# EAGLE design breakout (EAGLE 6.6.0)
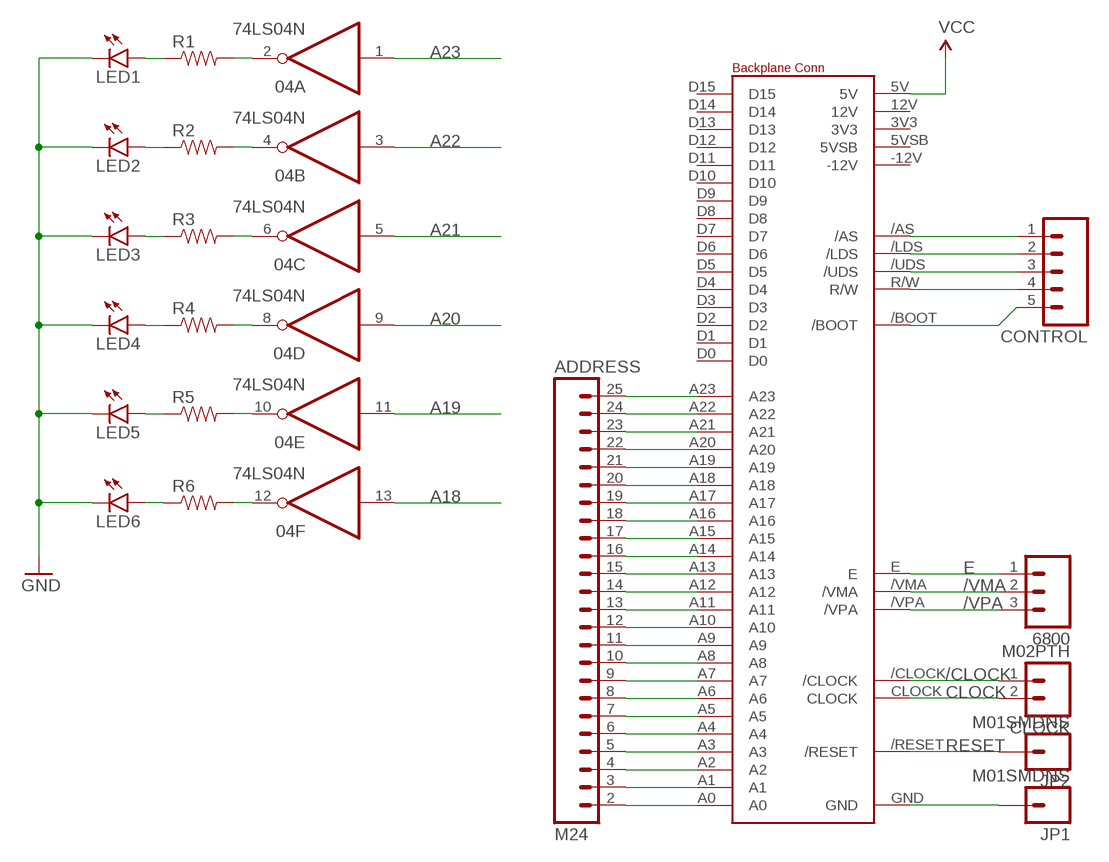
[diagram p0: schematic, sheet 1]

## Parts
04  74LS04N  [DIL14]
6800  M03PTH  [1X03]
ADDRESS  M24  [1X24]
CLOCK  M02PTH  [1X02]
CONTROL  M05PTH  [1X05]
JP1  M01SMDNS  [1X01NS]
JP2  M01SMDNS  [1X01NS]
LED1  LED1206  [LED-1206]
LED2  LED1206  [LED-1206]
LED3  LED1206  [LED-1206]
LED4  LED1206  [LED-1206]
LED5  LED1206  [LED-1206]
LED6  LED1206  [LED-1206]
R1  RESISTOR0603-RES  [0603-RES]
R2  RESISTOR0603-RES  [0603-RES]
R3  RESISTOR0603-RES  [0603-RES]
R4  RESISTOR0603-RES  [0603-RES]
R5  RESISTOR0603-RES  [0603-RES]
R6  RESISTOR0603-RES  [0603-RES]
U$1  BACKPLANENOHOLES  [41612-C]

## Nets
/AS: CONTROL.1 U$1./AS
/BOOT: CONTROL.5 U$1./BOOT
/CLOCK: CLOCK.1 U$1./CLOCK
/LDS: CONTROL.2 U$1./LDS
/UDS: CONTROL.3 U$1./UDS
/VMA: 6800.2 U$1./VMA
/VPA: 6800.3 U$1./VPA
A0: ADDRESS.2 U$1.A0
A1: ADDRESS.3 U$1.A1
A2: ADDRESS.4 U$1.A2
A3: ADDRESS.5 U$1.A3
A4: ADDRESS.6 U$1.A4
A5: ADDRESS.7 U$1.A5
A6: ADDRESS.8 U$1.A6
A7: ADDRESS.9 U$1.A7
A8: ADDRESS.10 U$1.A8
A9: ADDRESS.11 U$1.A9
A10: ADDRESS.12 U$1.A10
A11: ADDRESS.13 U$1.A11
A12: ADDRESS.14 U$1.A12
A13: ADDRESS.15 U$1.A13
A14: ADDRESS.16 U$1.A14
A15: ADDRESS.17 U$1.A15
A16: ADDRESS.18 U$1.A16
A17: ADDRESS.19 U$1.A17
A18: 04.13(F:I) ADDRESS.20 U$1.A18
A19: 04.11(E:I) ADDRESS.21 U$1.A19
A20: 04.9(D:I) ADDRESS.22 U$1.A20
A21: 04.5(C:I) ADDRESS.23 U$1.A21
A22: 04.3(B:I) ADDRESS.24 U$1.A22
A23: 04.1(A:I) ADDRESS.25 U$1.A23
CLOCK: CLOCK.2 U$1.CLOCK
E: 6800.1 U$1.E
GND: JP1.1 LED1.C LED2.C LED3.C LED4.C LED5.C LED6.C U$1.GND
N$1: 04.2(A:O) R1.2
N$2: 04.4(B:O) R2.2
N$3: 04.6(C:O) R3.2
N$4: 04.8(D:O) R4.2
N$5: 04.10(E:O) R5.2
N$6: 04.12(F:O) R6.2
N$7: LED6.A R6.1
N$8: LED5.A R5.1
N$9: LED4.A R4.1
N$10: LED3.A R3.1
N$11: LED2.A R2.1
N$12: LED1.A R1.1
R/W: CONTROL.4 U$1.R/W
RESET: JP2.1 U$1./RESET
VCC: U$1.5V
Unconnected: U$1.3V3 U$1.5VSB U$1.12V U$1.-12V U$1.D0 U$1.D1 U$1.D2 U$1.D3 U$1.D4 U$1.D5 U$1.D6 U$1.D7 U$1.D8 U$1.D9 U$1.D10 U$1.D11 U$1.D12 U$1.D13 U$1.D14 U$1.D15

## Power pins joined to a net without a drawn wire
GND: 04.7(P:GND)
VCC: 04.14(P:VCC)

## Library data of the parts
04 = 74xx-eu:74*04: Hex INVERTER
6800 = SparkFun-Connectors:M03: Header 3 Standard 3-pin 0.1" header. Use with straight break away headers (SKU : PRT-00116), right angle break away headers (PRT-00553), swiss pins (PRT-00743), machine pins (PRT-00117), and female headers (PRT-00115). Molex polarized connector foot print use with SKU : PRT-08232 with associated crimp pins and housings.
ADDRESS = SparkFun-Connectors:M24: 1x24 .1" header
CLOCK = SparkFun-Connectors:M02: Standard 2-pin 0.1" header. Use with - straight break away headers ( PRT-00116) - right angle break away headers (PRT-00553) - swiss pins (PRT-00743) - machine pins (PRT-00117) - female headers (PRT-00115) Molex polarized connector foot print use with: PRT-08233 with associated crimp pins and housings. 2.54_SCREWTERM for use with PRT-10571. 3.5mm Screw Terminal footprints for PRT-08084 5mm Screw Terminal footprints for use with PRT-08432
CONTROL = SparkFun-Connectors:M05: Header 5 Standard 5-pin 0.1" header. Use with straight break away headers (SKU : PRT-00116), right angle break away headers (PRT-00553), swiss pins (PRT-00743), machine pins (PRT-00117), and female headers (PRT-00115). Molex polarized connector foot print use with SKU : PRT-08230 with associated crimp pins and housings.
JP1 JP2 = SparkFun-Connectors:M01: Header 1 Standard 1-pin 0.1" header. Use with straight break away headers (SKU : PRT-00116), right angle break away headers (PRT-00553), swiss pins (PRT-00743), machine pins (PRT-00117), and female headers (PRT-00115).
LED1-LED6 = SparkFun-LED:LED: LEDs Standard schematic elements and footprints for 5mm, 3mm, 1206, and 0603 sized LEDs. 5mm - Spark Fun Electronics SKU : COM-00529 (and others)
R1-R6 = SparkFun-Passives:RESISTOR: Resistor Basic schematic elements and footprints for 0603, 1206, and PTH resistors.
U$1 = Benchoff2:BACKPLANENOHOLES

## Board
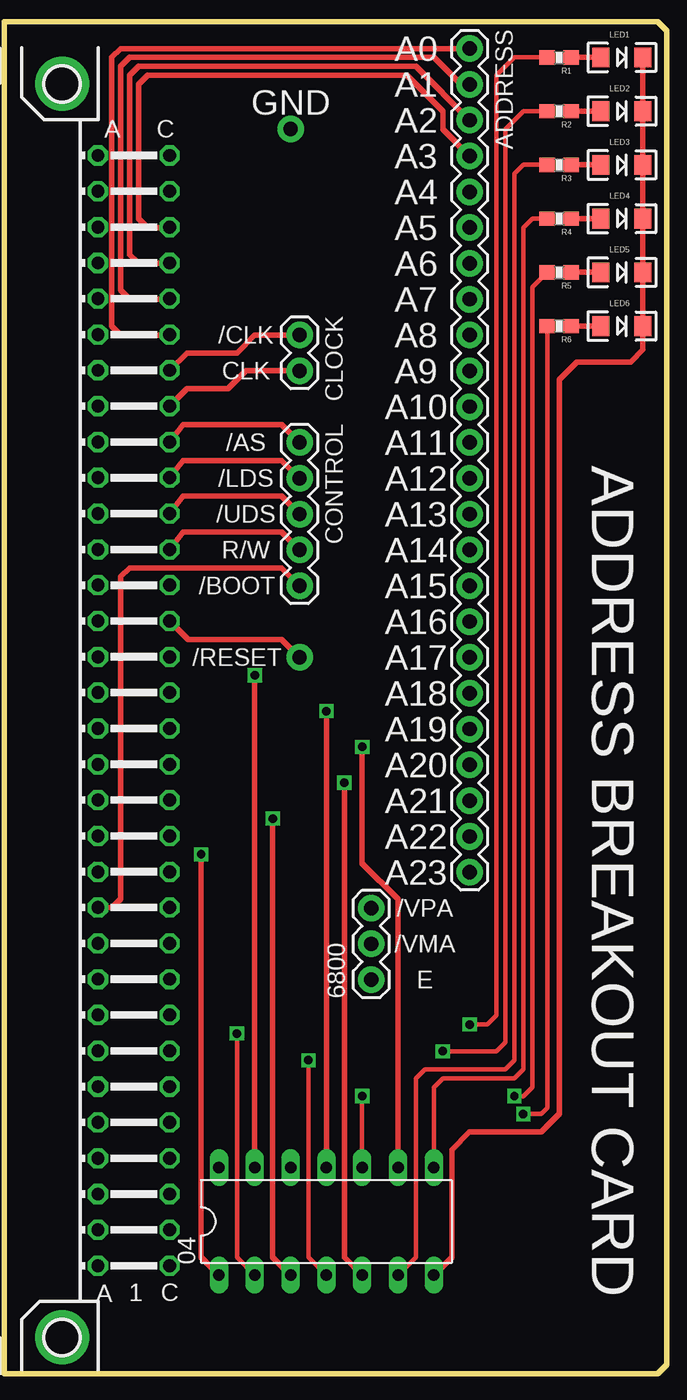
[diagram p1: board, top side]
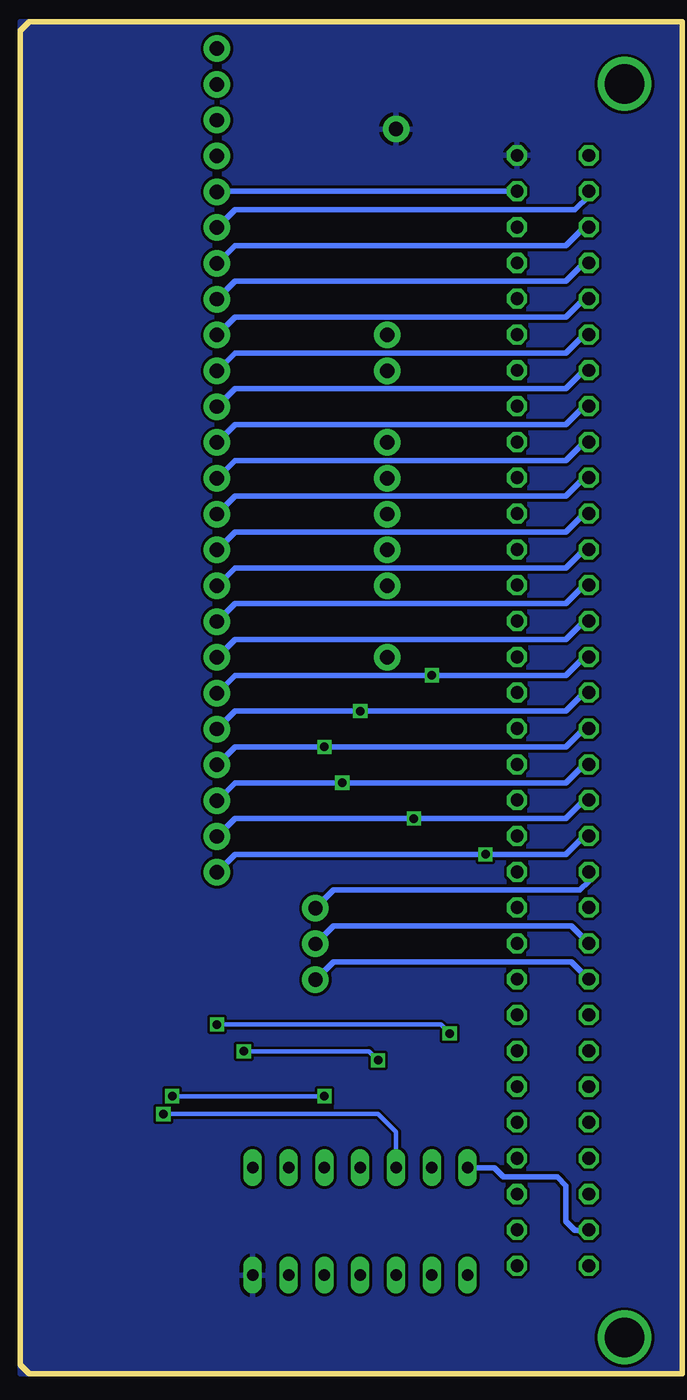
[diagram p2: board, bottom side, seen from below]

No outline drawn. Coordinates in mm, seen from the top.
Copper layers (1*16): Top 0.035mm / dielectric 1.5mm / Bottom 0.035mm
Design rules "default *": minimum track width 10mil, minimum drill 24mil, track to track 8mil, track to pad 8mil, pad to pad 8mil, via to via 8mil, smd to smd 8mil, copper to edge 40mil, drill to drill 8mil, minimum pad ring 10mil, minimum via ring 8mil, stop-mask expansion 4mil, vias tented up to drill 25mil, thermal gap 10mil
Milling: 6 lines

### Footprints (pad centres in the part's own frame; a part is rotated, then mirrored left to right if it is on the bottom)
DIL14 = drill 0.813 long: 1 -7.62,-3.81; 2 -5.08,-3.81; 3 -2.54,-3.81; 4 0,-3.81; 5 2.54,-3.81; 6 5.08,-3.81; 7 7.62,-3.81; 8 7.62,3.81; 9 5.08,3.81; 10 2.54,3.81; 11 0,3.81; 12 -2.54,3.81; 13 -5.08,3.81; 14 -7.62,3.81
1X03 = drill 1.016 pad 1.88: 1 0,0; 2 2.54,0; 3 5.08,0
1X24 = drill 1.016 pad 1.88: 2 -26.67,0; 3 -24.13,0; 4 -21.59,0; 5 -19.05,0; 6 -16.51,0; 7 -13.97,0; 8 -11.43,0; 9 -8.89,0; 10 -6.35,0; 11 -3.81,0; 12 -1.27,0; 13 1.27,0; 14 3.81,0; 15 6.35,0; 16 8.89,0; 17 11.43,0; 18 13.97,0; 19 16.51,0; 20 19.05,0; 21 21.59,0; 22 24.13,0; 23 26.67,0; 24 29.21,0; 25 31.75,0
1X02 = drill 1.016 pad 1.88: 1 0,0; 2 2.54,0
1X05 = drill 1.016 pad 1.88: 1 0,0; 2 2.54,0; 3 5.08,0; 4 7.62,0; 5 10.16,0
1X01NS = drill 1.016 pad 1.88: 1 0,0
LED-1206 = smd 1.2 x 1.4: A -1.5,0; C 1.5,0
0603-RES = smd 1.1 x 1: 1 -0.85,0; 2 0.85,0
41612-C = drill 0.914 octagon: 3V3 -5.381,39.968; 5V -0.301,37.428; 5VSB -5.381,37.428; 12V -0.301,39.968; -12V -0.301,-38.772; /AS -5.381,-18.452; /BOOT -0.301,14.568; /CLOCK -5.381,-23.532; /LDS -5.381,-15.912; /RESET -5.381,-5.752; /UDS -5.381,-13.372; /VMA -0.301,17.108; /VPA -0.301,12.028; A0 -5.381,-26.072; A1 -5.381,-28.612; A2 -5.381,-31.152; A3 -5.381,-33.692; A4 -5.381,-36.232; A5 -0.301,-36.232; A6 -0.301,-33.692; A7 -0.301,-31.152; A8 -0.301,-28.612; A9 -0.301,-26.072; A10 -0.301,-23.532; A11 -0.301,-20.992; A12 -0.301,-18.452; A13 -0.301,-15.912; A14 -0.301,-13.372; A15 -0.301,-10.832; A16 -0.301,-8.292; A17 -0.301,-5.752; A18 -0.301,-3.212; A19 -0.301,-0.672; A20 -0.301,1.868; A21 -0.301,4.408; A22 -0.301,6.948; A23 -0.301,9.488; C13 -5.381,9.488; C14 -5.381,6.948; C15 -5.381,4.408; C16 -5.381,1.868; C17 -5.381,-0.672; C18 -5.381,-3.212; C20 -5.381,-8.292; CLOCK -5.381,-20.992; D0 -0.301,22.188; D1 -0.301,24.728; D2 -0.301,27.268; D3 -0.301,29.808; D4 -0.301,32.348; D5 -0.301,34.888; D6 -5.381,34.888; D7 -5.381,32.348; D8 -5.381,29.808; D9 -5.381,27.268; D10 -5.381,24.728; D11 -5.381,22.188; D12 -5.381,19.648; D13 -5.381,17.108; D14 -5.381,14.568; D15 -5.381,12.028; E -0.301,19.648; GND -5.381,-38.772; R/W -5.381,-10.832 | drill 2.8: P$1 2.239,45.048; P$2 2.239,-43.852

### Placement (x,y rotation side)
04  16.51,15.24 0 top
6800  19.68,32.38 90 top
ADDRESS  26.67,71.75 270 top
CLOCK  14.61,78.11 270 top
CONTROL  14.61,70.48 270 top
JP1  13.97,92.71 180 top
JP2  14.61,55.24 180 top
LED1  37.47,97.79 0 top
LED2  37.47,93.98 0 top
LED3  37.47,90.17 0 top
LED4  37.47,86.36 0 top
LED5  37.47,82.55 0 top
LED6  37.47,78.74 0 top
R1  33.02,97.79 180 top
R2  33.02,93.98 180 top
R3  33.02,90.17 180 top
R4  33.02,86.36 180 top
R5  33.02,82.55 180 top
R6  33.02,78.74 180 top
U$1  0,52.07 180 top

### Tracks (layer width: path | path; a pad name or v marks a point on that pad's centre or on a via)
/AS
  Top 0.406: CONTROL.1 13.34,71.75 6.35,71.75 U$1./AS
/BOOT
  Top 0.406: CONTROL.5 13.34,61.59 2.54,61.59 1.91,60.96 1.91,38.1 1.27,37.47 U$1./BOOT
/CLOCK
  Top 0.406: CLOCK.1 11.43,78.11 10.16,76.83 6.61,76.83 U$1./CLOCK
/LDS
  Top 0.406: CONTROL.2 13.34,69.22 6.35,69.22 U$1./LDS
/UDS
  Top 0.406: CONTROL.3 13.34,66.67 6.35,66.67 U$1./UDS
/VMA
  Bottom 0.406: U$1./VMA 1.53,36.2 18.41,36.2 6800.2
/VPA
  Bottom 0.406: U$1./VPA 0.3,39.37 0.94,38.73 18.41,38.73 6800.3
A0
  Top 0.406: ADDRESS.2 1.91,98.42 1.27,97.79 1.27,78.74 1.91,78.11 5.34,78.11 U$1.A0
A1
  Top 0.406: ADDRESS.3 26.04,95.89 24.13,97.79 2.54,97.79 1.91,97.16 1.91,81.28 2.54,80.64 5.34,80.64 U$1.A1
A2
  Top 0.406: ADDRESS.4 22.86,97.16 3.17,97.16 2.54,96.52 2.54,83.82 3.17,83.19 5.34,83.19 U$1.A2
A3
  Top 0.406: ADDRESS.5 24.77,92.71 24.77,93.98 22.23,96.52 3.81,96.52 3.17,95.89 3.17,86.36 3.81,85.72 5.34,85.72 U$1.A3
A4
  Bottom 0.406: U$1.A4 26.67,88.3 ADDRESS.6
A5
  Bottom 0.406: U$1.A5 0.3,87.96 1.27,87 25.4,87 ADDRESS.7
A6
  Bottom 0.406: U$1.A6 0.6,85.76 1.91,84.45 25.4,84.45 ADDRESS.8
A7
  Bottom 0.406: U$1.A7 0.6,83.22 1.91,81.92 25.4,81.92 ADDRESS.9
A8
  Bottom 0.406: U$1.A8 0.6,80.68 1.91,79.38 25.4,79.38 ADDRESS.10
A9
  Bottom 0.406: U$1.A9 0.6,78.14 1.91,76.83 25.4,76.83 ADDRESS.11
A10
  Bottom 0.406: U$1.A10 0.6,75.6 1.91,74.3 25.4,74.3 ADDRESS.12
A11
  Bottom 0.406: U$1.A11 0.6,73.06 1.91,71.75 25.4,71.75 ADDRESS.13
A12
  Bottom 0.406: U$1.A12 0.6,70.52 1.91,69.22 25.4,69.22 ADDRESS.14
A13
  Bottom 0.406: U$1.A13 0.6,67.98 1.91,66.67 25.4,66.67 ADDRESS.15
A14
  Bottom 0.406: U$1.A14 0.6,65.44 1.91,64.14 25.4,64.14 ADDRESS.16
A15
  Bottom 0.406: U$1.A15 0.6,62.9 1.91,61.59 25.4,61.59 ADDRESS.17
A16
  Bottom 0.406: U$1.A16 0.6,60.36 1.91,59.05 25.4,59.05 ADDRESS.18
A17
  Bottom 0.406: U$1.A17 0.6,57.82 1.91,56.52 25.4,56.52 ADDRESS.19
A18  (via drill 0.6)
  Top 0.406: 04.13 v11.43,53.98
  Bottom 0.406: U$1.A18 0.6,55.28 1.91,53.98 v11.43,53.98 25.4,53.98 ADDRESS.20
A19  (via drill 0.6)
  Top 0.406: 04.11 v16.51,51.44
  Bottom 0.406: U$1.A19 0.6,52.74 1.91,51.44 v16.51,51.44 25.4,51.44 ADDRESS.21
A20  (via drill 0.6)
  Top 0.406: 04.9 21.59,38.1 19.05,40.64 v19.05,48.9
  Bottom 0.406: U$1.A20 0.6,50.2 1.91,48.9 v19.05,48.9 25.4,48.9 ADDRESS.22
A21  (via drill 0.6)
  Top 0.406: 04.5 17.78,12.7 v17.78,46.35
  Bottom 0.406: U$1.A21 0.6,47.66 1.91,46.35 v17.78,46.35 25.4,46.35 ADDRESS.23
A22  (via drill 0.6)
  Top 0.406: 04.3 12.7,12.7 v12.7,43.81
  Bottom 0.406: U$1.A22 0.6,45.12 1.91,43.81 v12.7,43.81 25.4,43.81 ADDRESS.24
A23  (via drill 0.6)
  Top 0.406: 04.1 7.62,12.7 v7.62,41.27
  Bottom 0.406: U$1.A23 0.6,42.58 1.91,41.27 v7.62,41.27 25.4,41.27 ADDRESS.25
CLOCK
  Top 0.406: CLOCK.2 10.79,75.56 9.53,74.3 6.61,74.3 U$1.CLOCK
E
  Bottom 0.406: U$1.E 1.53,33.66 18.41,33.66 6800.1
GND
  Top 0.406: 04.7 25.4,12.7 25.4,20.32 26.67,21.59 31.75,21.59 33.02,22.86 33.02,74.93 34.29,76.2 38.1,76.2 38.97,77.06 LED6.C LED5.C LED4.C LED3.C LED2.C LED1.C
  pour Bottom: -6.35,100.33 40.64,100.33 40.64,4.45 -6.35,4.45
N$1  (via drill 0.6)
  Top 0.305: R1.2 29.84,97.79 28.57,96.52 28.57,29.84 27.94,29.21 v26.67,29.21 | v10.16,28.57 10.16,12.7 04.2
  Bottom 0.305: v26.67,29.21 10.79,29.21 v10.16,28.57
N$2  (via drill 0.6)
  Top 0.305: R2.2 30.48,93.98 29.21,92.71 29.21,27.94 28.57,27.3 v24.77,27.3 | v15.24,26.67 15.24,12.7 04.4
  Bottom 0.305: v24.77,27.3 15.88,27.3 v15.24,26.67
N$3
  Top 0.305: R3.2 30.48,90.17 29.84,89.53 29.84,26.67 29.21,26.04 23.5,26.04 22.86,25.4 22.86,12.7 04.6
N$4
  Top 0.305: R4.2 31.11,86.36 30.48,85.72 30.48,26.04 29.84,25.4 24.77,25.4 24.13,24.77 04.8
N$5  (via drill 0.6)
  Top 0.305: R5.2 31.11,81.5 31.11,24.77 30.48,24.13 v29.84,24.13 | v19.05,24.13 04.10
  Bottom 0.305: v29.84,24.13 v19.05,24.13
N$6  (via drill 0.6)
  Top 0.305: R6.2 32.17,23.28 31.75,22.86 v30.48,22.86
  Bottom 0.305: v30.48,22.86 15.24,22.86 13.97,21.59 04.12
N$7
  Top 0.406: LED6.A R6.1
N$8
  Top 0.406: LED5.A R5.1
N$9
  Top 0.406: LED4.A R4.1
N$10
  Top 0.406: LED3.A R3.1
N$11
  Top 0.406: LED2.A R2.1
N$12
  Top 0.406: LED1.A R1.1
R/W
  Top 0.406: CONTROL.4 13.34,64.14 6.35,64.14 U$1.R/W
RESET
  Top 0.406: JP2.1 13.34,56.52 6.69,56.52 U$1./RESET
VCC
  Bottom 0.406: 04.14 6.99,19.05 6.35,18.41 2.54,18.41 1.91,17.78 1.91,15.24 1.27,14.61 0.34,14.61 U$1.5V

### Text on the board
tPlace: A0 | A1 | GND | A2 | A3 | A4 | A5 | A6 | A7 | /CLK | A8 | CLK | A9 | A10 | /AS | A11 | /LDS | A12 | /UDS | A13 | R/W | A14 | /BOOT | A15 | A16 | /RESET | A17 | A18 | A19 | A20 | A21 | A22 | A23 | ADDRESS BREAKOUT CARD | /VPA | /VMA | E